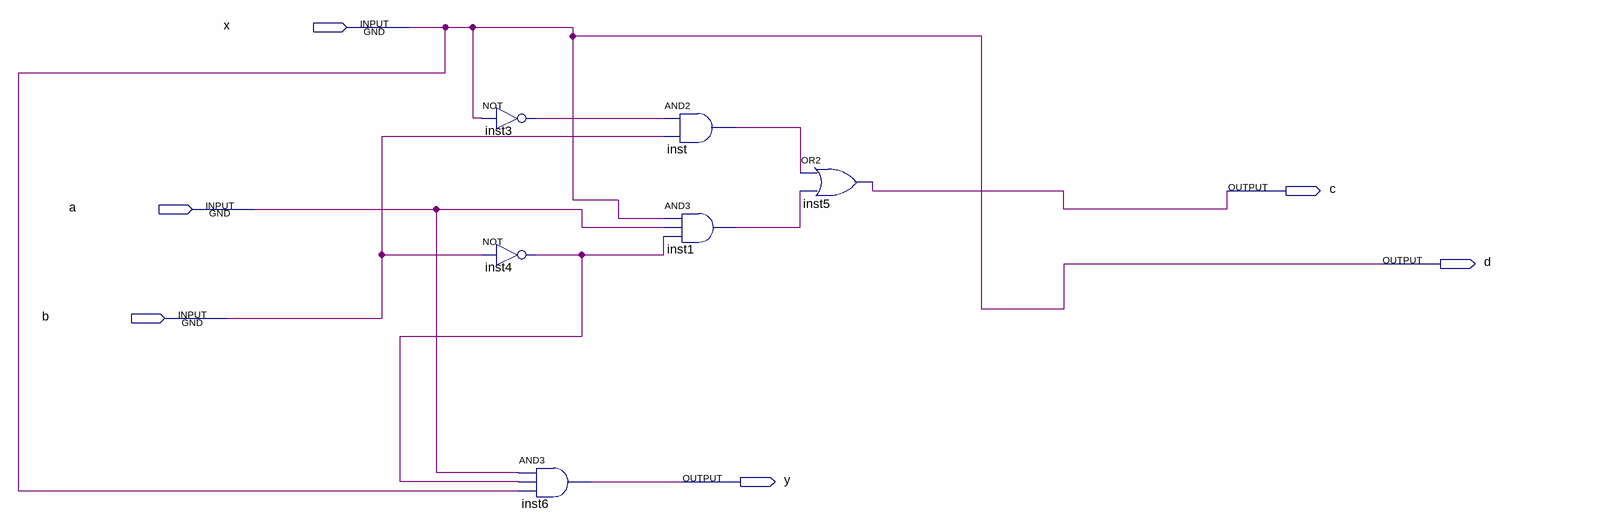
[diagram p0: schematic sheet]
// Quartus schematic block1.bdf as structural Verilog: 6 symbols, 6 pins
module block1 (
  input  x,
  input  a,
  input  b,
  output c,
  output d,
  output y
);

  wire inst1_out, inst3_out, inst4_out, inst_out;

  not inst3 (inst3_out, x);
  not inst4 (inst4_out, b);
  and inst6 (y, a, inst4_out, x);
  and inst (inst_out, inst3_out, b);
  and inst1 (inst1_out, x, a, inst4_out);
  or inst5 (c, inst_out, inst1_out);

  assign d = x;
endmodule
